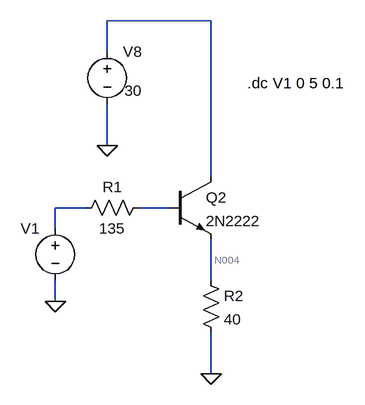
[diagram p0: schematic npn.asc]
npn.asc, the LTspice schematic file:
Version 4
SHEET 1 2516 1360
WIRE 816 224 656 224
WIRE 656 272 656 224
WIRE 656 416 656 352
WIRE 816 464 816 224
WIRE 624 512 576 512
WIRE 752 512 704 512
WIRE 576 544 576 512
WIRE 816 624 816 560
WIRE 576 656 576 624
WIRE 816 768 816 704
FLAG 656 416 0
FLAG 576 656 0
FLAG 816 768 0
SYMBOL voltage 656 256 R0
WINDOW 3 27 76 Left 2
WINDOW 123 0 0 Left 2
WINDOW 39 0 0 Left 2
SYMATTR Value 30
SYMATTR InstName V8
SYMBOL npn 752 464 R0
SYMATTR InstName Q2
SYMATTR Value 2N2222
SYMBOL res 720 496 R90
WINDOW 0 0 56 VBottom 2
WINDOW 3 32 56 VTop 2
SYMATTR InstName R1
SYMATTR Value 135
SYMBOL voltage 576 528 M0
WINDOW 123 0 0 Left 2
WINDOW 39 0 0 Left 2
SYMATTR InstName V1
SYMATTR Value ""
SYMBOL res 800 608 R0
SYMATTR InstName R2
SYMATTR Value 40
SYMATTR SpiceLine tol=1 pwr=1
TEXT 872 320 Left 2 !.dc V1 0 5 0.1

The netlist it stands for:
* npn.asc
V8 N001 0 30
Q2 N001 N003 N004 0 2N2222
R1 N003 N002 135
V1 N002 0
R2 N004 0 40 tol=1 pwr=1
.model NPN NPN
.model PNP PNP
.lib standard.bjt
.dc V1 0 5 0.1
.backanno
.end

* Results of the author's LTspice run, read from the files saved beside the schematic
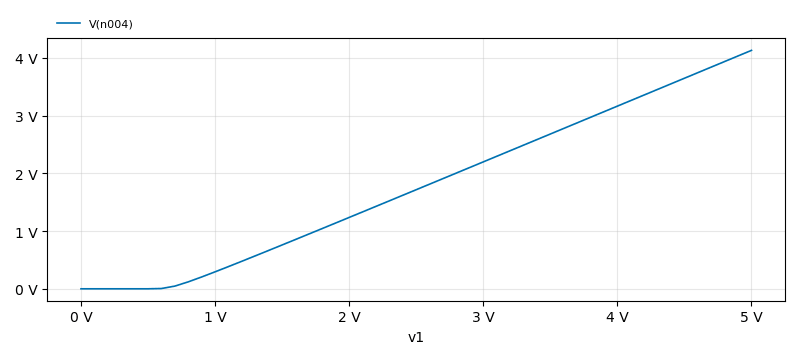
[diagram p1: DC transfer characteristic of npn.asc, plotted from the saved traces]
* DC transfer characteristic, 1 run:
*   V(n004): 520 fV at v1=0 V, 4.128 V at v1=5 V, min 520 fV, max 4.128 V